# Altium project LED驱动.PrjPCB
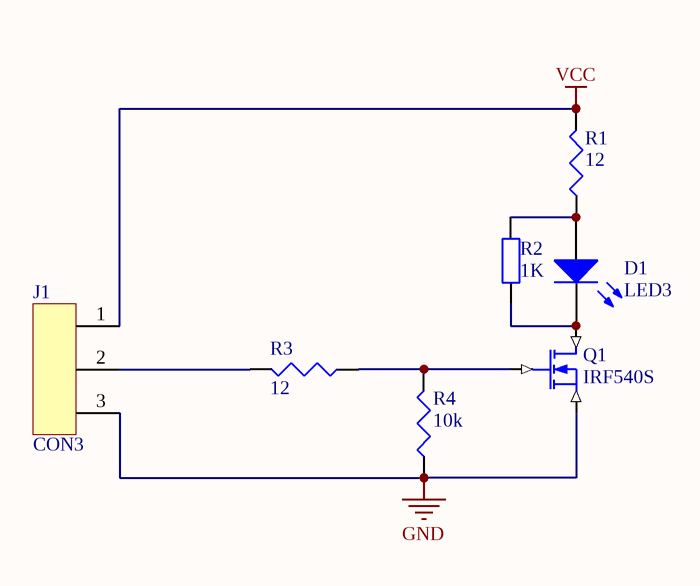
[diagram p0: 原理图.SchDoc]
1 sheet, 7 parts. Net scope: global (net labels, ports and power ports of the same name join across sheets).
Board file: PCB_LED.PcbDoc

## Sheet 原理图.SchDoc
size A4

### Parts
D1  LED3  [3.5X2.8X1.9]
J1  CON3  [SIP-3]
Q1  IRF540S  [TO-263-2]
R1  12  [J1-0603]
R2  value 1K  [AXIAL0.3]  (hidden comment: Res)
R3  12  [J1-0603]
R4  10k  [J1-0603]

### Nets
GND: J1.3 Q1.3(S) R4.1
VCC: J1.1 R1.2
NetD1_1: D1.1(A) R1.1 R2.2
NetD1_2: D1.2(K) Q1.1(D) R2.1
NetJ1_2: J1.2 R3.2
NetQ1_2: Q1.2(G) R3.1 R4.2

### Library data of the parts
D1 = LED3: Typical BLUE SiC LED; Published: 8-Jun-2000; LatestRevisionDate: 17-Dec-2003; LatestRevisionNote: PCB Footprint replaced.; DatasheetVersion: 16-Apr-2002; PackageVersion: 16-Apr-2002; PackageReference: 3.5X2.8X1.9; Publisher: Altium Limited; PackageDescription: SM LED; 2 C-Bend Leads; Body 3.5 x 2.8 x 1.9 mm, inc leads (LxWxH typ)
J1 = CON3: SOCKET
Q1 = IRF540S: N-Channel MOSFET
R1 R3 R4 = Res3: Resistor; Published: 8-Jun-2000; LatestRevisionDate: 29-May-2009; LatestRevisionNote: IPC-7351 Footprint Added.; PackageReference: J1-0603; Publisher: Altium Limited; PackageDescription: Chip Resistor